# EasyEDA Pro project 数控UPS.epro, board 12-5v
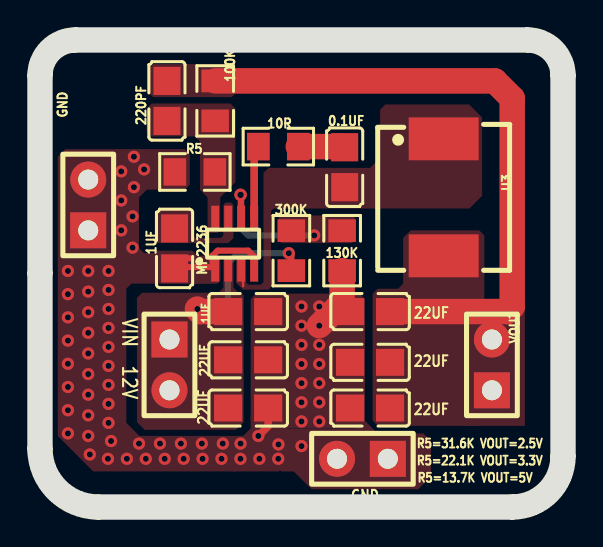
[diagram p5: board, top side]
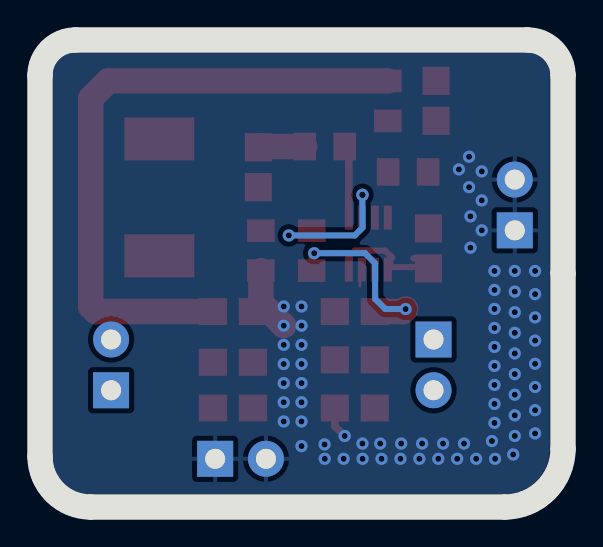
[diagram p6: board, bottom side, seen from below]

Outline 26.16 x 23.37 mm; copper layers: Top Layer, Bottom Layer. Coordinates in mm from the lower left corner of the outline.
Outline path: 0,21.59 arc(0.52,22.85) 1.78,23.37 24.38,23.37 arc(25.64,22.85) 26.16,21.59 26.16,2.54 arc(25.42,0.74) 23.62,0 2.92,0 arc(0.86,0.86) 0,2.92 0,21.59
Stack: Top Layer 0.035mm / Dielectric1 1.51mm FR4 er 4.5 / Bottom Layer 0.035mm

## Design rules (mm)
template: JLCPCB Capability(Two Layers Board)
spacing copperThickness1oz (default): track to track 0.102, other pairs 0.152 to 0.3
spacing copperThickness2oz: track to track 0.203, other pairs 0.152 to 0.3
track width copperThickness1oz (default): min 0.127, default 0.254, max 2.54
track width copperThickness2oz: min 0.203, default 0.254, max 2.54
differential pair differentialPair (default): width min 0.127, default 0.254, max 2.54; gap min 0.152, default 0.152
via viaSize (default): diameter min 0.5, default 0.61, max 10; hole min 0.3, default 0.305, max 6.3

## Placement (name value [footprint] x y rotation side)
0.1UF  -  [C0805]  15.24 17 90 top
1UF  -  [C0805]  6.73 12.94 90 top
1UF#2  -  [C0805]  10.41 9.78 180 top
10R  -  [R0805]  11.92 18.03 0 top
22UF  -  [HDR-TH_2P-P2.54-V-M-1]  6.48 7.11 270 top
100K  -  [R0805]  8.76 20.32 90 top
130K  -  [R0805]  15.11 12.83 90 top
220PF  -  [C0805]  6.35 20.32 90 top
300K  -  [R0805]  12.57 12.83 270 top
C1  22uf  [C0805]  10.41 4.95 180 top
C2  22uf  [C0805]  10.41 7.37 180 top
C6  22uf  [C0805]  16.51 9.78 0 top
C7  22uf  [C0805]  16.51 7.24 0 top
C8  22uf  [C0805]  16.51 4.95 0 top
GND
  -  [HDR-TH_2P-P2.54-V-M-1]  2.41 15.11 90 top
H4  -  [HDR-TH_2P-P2.54-V-M-1]  16.13 2.41 180 top
MP2236  -  [MP2236]  8.76 14.48 0 top
R5  13.7K  [R0805]  7.75 16.76 0 top
U3  3.3uh  [IND-SMD_L6.8-W6.8_SMMS0630]  20.19 15.49 270 top
VOUT  -  [HDR-TH_2P-P2.54-V-M-1]  22.61 7.11 90 top

## Footprints (pads in the part's own frame, mm; a bottom-side part is the same pattern mirrored in y, then rotated)
C0805
  rect 1.41x1.35 smd: 1(-1,0) 2(1,0)
HDR-TH_2P-P2.54-V-M-1
  rect 1.8x1.8 hole 1: 1(-1.27,0)
  round 1.8 hole 1: 2(1.27,0)
IND-SMD_L6.8-W6.8_SMMS0630
  rect 2.15x3.5 smd: 1(-2.925,0) 2(2.925,0)
MP2236
  rect 0.4x1.2 smd: 1(0,-2.6) 2(0.65,-2.6) 3(1.3,-2.6) 4(1.95,-2.6) 5(1.95,0) 6(1.3,0) 7(0.65,0) 8(0,0)
R0805
  rect 1.133x1.377 smd: 1(-1,0) 2(1,0)

## Nets
GND: 1UF.1 1UF#2.1 130K.1 C1.1 C2.1 C6.1 C7.1 C8.1 GND
.1 GND
.2 H4.1 H4.2 MP2236.1 MP2236.4 R5.1
VOUT: 100K.2 220PF.2 C6.2 C7.2 C8.2 U3.2 VOUT.1 VOUT.2
$1N168: 1UF#2.2 22UF.1 22UF.2 300K.2 C1.2 C2.2 MP2236.2
$1N171: 130K.2 300K.1 MP2236.6
$1N800: 1UF.2 MP2236.7
$1N1061: 10R.1 MP2236.5
$1N1238: 0.1UF.2 10R.2
$1N1269: 0.1UF.1 MP2236.3 U3.1
$1N1940: 100K.1 220PF.1 MP2236.8 R5.2

## Via types
v1: diameter 0.61, hole 0.305, Top Layer to Bottom Layer, 74 vias

## Routing (per net, layer and track width the routed paths; a pad name or vN(x,y) marks a point on that pad's centre or on a via; arc(x,y) is an arc through that point)
GND: length 11.3
  Top Layer w0.305: 8.64,12.57 8.89,12.83 10.41,12.83 10.71,12.53 MP2236.4 ; 8.64,12.57 8.64,12 6.8,12 ; 8.64,12.57 8.54,12.48 ; 1UF.1 6.8,12 ; 6.8,12 7.24,12.45 7.49,12.45
  Top Layer w0.381: C1.1 11.41,4.05 v1(10.92,3.56)
  Top Layer w1.27: v1(13.97,9.07) 15.11,10.22 130K.1
  vias: v1(1.4,11.81) v1(1.4,10.65) v1(1.4,9.49) v1(1.4,8.33) v1(1.4,7.17) v1(1.4,6.01) v1(1.4,4.84) v1(1.4,3.68) v1(2.41,11.81) v1(2.41,10.78) v1(2.41,9.75) v1(2.41,8.72) v1(2.41,7.68) v1(2.41,6.65) v1(2.41,5.62) v1(2.41,4.59) v1(2.41,3.56) v1(2.49,2.63) v1(3.4,2.41) v1(3.43,11.81) v1(3.43,10.86) v1(3.43,9.91) v1(3.43,8.96) v1(3.43,8.01) v1(3.43,7.06) v1(3.43,6.11) v1(3.43,5.16) v1(3.43,4.21) v1(3.56,3.3) v1(4.06,16.79) v1(4.06,15.34) v1(4.06,13.84) v1(4.35,2.41) v1(4.7,17.53) v1(4.7,16) v1(4.63,14.54) v1(4.63,12.98) v1(4.95,3.17) v1(5.21,16.89) v1(5.29,2.41) v1(6,3.17) v1(6.24,2.41) v1(7.05,3.17) v1(7.19,2.41) v1(8.1,3.17) v1(8.13,2.41) v1(9.08,2.41) v1(9.14,3.17) v1(10.03,3.17) v1(10.03,2.41) v1(10.97,2.41) v1(11.93,3.13) v1(11.92,2.41) v1(13.08,10.03) v1(13.08,9.07) v1(13.08,8.12) v1(13.08,7.16) v1(13.08,6.2) v1(13.08,5.24) v1(13.08,4.28) v1(13.08,3.05) v1(13.97,10.03) v1(13.97,8.12) v1(13.97,7.16) v1(13.97,6.2) v1(13.97,5.24) v1(13.97,4.28)
VOUT: length 31.9
  Top Layer w1.27: C6.2 23.37,9.78 23.62,10.03 23.62,20.45 22.75,21.32 100K.2
$1N168: length 9.3
  Top Layer w0.305: v1(12.45,12.7) 12.57,12.57 300K.2
  Top Layer w1.27: v1(7.87,9.91) 8,9.78 1UF#2.2
  Bottom Layer w0.305: v1(12.45,12.7) 9.91,12.7 9.4,12.19 9.4,10.41 8.89,9.91 v1(7.87,9.91)
$1N171: length 6.6
  Top Layer w0.305: v1(10.03,15.62) 10.06,15.59 MP2236.6
  Bottom Layer w0.305: v1(13.72,13.59) 10.41,13.59 10.03,13.97 v1(10.03,15.62)
$1N1061: length 3.6
  Top Layer w0.381: 10R.1 10.71,17.83 MP2236.5
$1N1238: length 2.3
  Top Layer w1.27: 0.1UF.2 15.21,18.03 10R.2
$1N1269: length 0.9
  Top Layer w0.127: 10.16,11.05 10.16,11.78 MP2236.3

## Copper pours and planes (outline as drawn; the poured copper is in the pictures)
GND on Top Layer: 10.54,10.68 16.26,10.68 16.26,3.94 10.54,3.94
GND on Top Layer: 0.89,17.91 4.68,17.91 4.68,2.92 0.89,2.92
GND on Top Layer: 5.97,12.7 9.02,12.7 9.02,11.18 5.97,11.18
GND on Top Layer: 3.81,17.91 11.18,17.91 11.18,2.92 3.81,2.92
GND on Top Layer: 9.52,4.2 12.38,4.2 12.38,1.78 9.52,1.78
GND on Top Layer: 1.52,4.05 12.08,4.05 12.08,1.78 1.52,1.78
GND on Top Layer: 4.32,17.91 9.02,17.91 9.02,11.18 4.32,11.18
GND on Top Layer: 11.94,4.33 19.56,4.33 19.56,0.89 11.94,0.89
GND on Bottom Layer: 0.93,22.44 1.65,22.73 24.38,22.73 25.19,22.4 25.53,21.59 25.53,2.54 24.97,1.19 23.62,0.64 2.95,0.64 1.33,1.3 0.66,2.92 0.66,21.69 0.65,21.71 0.63,21.72
VOUT on Top Layer: 16.64,13.84 22.22,13.84 22.22,4.05 16.64,4.05
VOUT on Top Layer: 5.4,22.16 9.84,22.16 9.84,20.51 5.4,20.51
VOUT on Top Layer: 21.34,10.41 24.26,10.41 24.26,4.06 21.34,4.06
$1N168 on Top Layer: 4.85,12.4 10.19,12.4 10.19,3.86 4.85,3.86
$1N171 on Top Layer: 11.94,14.59 15.75,14.59 15.75,13.21 11.94,13.21
$1N800 on Top Layer: 5.74,15.24 9.68,15.24 9.68,13.21 5.74,13.21
$1N1269 on Top Layer: 9.8,20.14 22.11,20.14 22.11,10.87 9.8,10.87
$1N1940 on Top Layer: 7.75,20.07 9.78,20.07 9.78,13.72 7.75,13.72
$1N1940 on Top Layer: 5.33,20.19 9.78,20.19 9.78,18.54 5.33,18.54

Small or netless copper shapes (teardrops, artwork), in the pictures only: 3 on Top Layer

## Text on the board
Top Silkscreen Layer: R5=31.6K VOUT=2.5V | R5=22.1K VOUT=3.3V | R5=13.7K VOUT=5V | 22UF | GND | VIN  12V
